# Altium schematic sheet MultimediaEthernet_SWD.SchDoc
size Letter
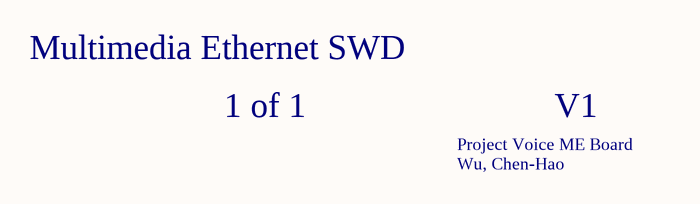
[diagram p0: MultimediaEthernet_SWD.SchDoc]

## Notes on the sheet
- Multimedia Ethernet SWD
- 1 of 1
- Project Voice ME Board
- V1
- Wu, Chen-Hao